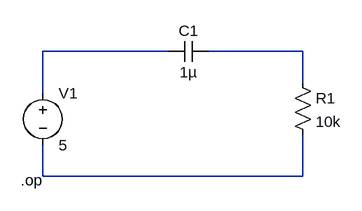
[diagram p0: schematic T2_1_RC_op.asc]
T2_1_RC_op.asc, the LTspice schematic file:
Version 4
SHEET 1 880 680
WIRE 192 96 0 96
WIRE 400 96 256 96
WIRE 400 144 400 96
WIRE 0 160 0 96
WIRE 0 288 0 240
WIRE 400 288 400 224
WIRE 400 288 0 288
SYMBOL voltage 0 144 R0
WINDOW 123 0 0 Left 0
WINDOW 39 0 0 Left 0
SYMATTR InstName V1
SYMATTR Value 5
SYMBOL cap 256 80 R90
WINDOW 0 0 32 VBottom 2
WINDOW 3 32 32 VTop 2
SYMATTR InstName C1
SYMATTR Value 1µ
SYMBOL res 384 128 R0
SYMATTR InstName R1
SYMATTR Value 10k
TEXT -34 294 Left 2 !.op

The netlist it stands for:
* T2_1_RC_op.asc
V1 N001 N003 5
C1 N002 N001 1µ
R1 N002 N003 10k
.op
.backanno
.end